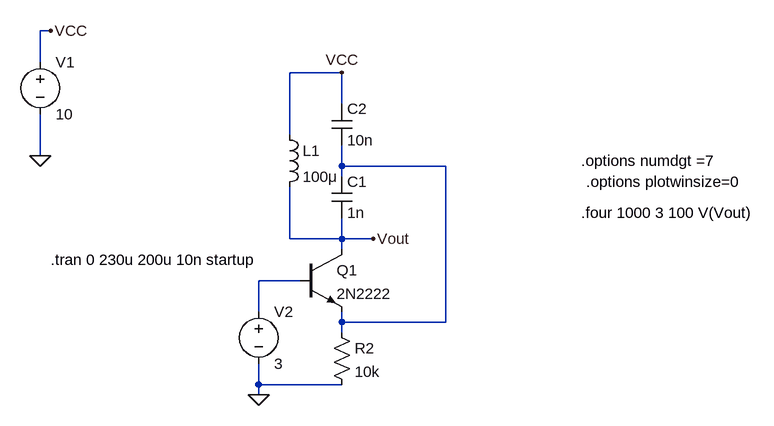
[diagram p0: schematic Ask2.asc]
Ask2.asc, the LTspice schematic file:
Version 4
SHEET 1 912 680
WIRE -224 -288 -240 -288
WIRE -240 -240 -240 -288
WIRE 224 -224 144 -224
WIRE 224 -176 224 -224
WIRE 144 -128 144 -224
WIRE -240 -96 -240 -160
WIRE 224 -80 224 -112
WIRE 384 -80 224 -80
WIRE 224 -64 224 -80
WIRE 144 32 144 -48
WIRE 224 32 224 0
WIRE 224 32 144 32
WIRE 272 32 224 32
WIRE 224 48 224 32
WIRE 160 96 96 96
WIRE 96 144 96 96
WIRE 224 160 224 144
WIRE 384 160 384 -80
WIRE 384 160 224 160
WIRE 224 176 224 160
WIRE 96 256 96 224
WIRE 224 256 96 256
WIRE 96 272 96 256
FLAG 96 272 0
FLAG 224 -224 VCC
FLAG -240 -96 0
FLAG -224 -288 VCC
FLAG 272 32 Vout
SYMBOL voltage 96 128 R0
SYMATTR InstName V2
SYMATTR Value 3
SYMBOL npn 160 48 R0
SYMATTR InstName Q1
SYMATTR Value 2N2222
SYMBOL res 208 160 R0
SYMATTR InstName R2
SYMATTR Value 10k
SYMBOL cap 208 -64 R0
SYMATTR InstName C1
SYMATTR Value 1n
SYMBOL cap 208 -176 R0
SYMATTR InstName C2
SYMATTR Value 10n
SYMBOL ind 128 -144 R0
SYMATTR InstName L1
SYMATTR Value 100μ
SYMBOL voltage -240 -256 R0
SYMATTR InstName V1
SYMATTR Value 10
TEXT -224 64 Left 2 !.tran 0 230u 200u 10n startup
TEXT 592 -88 Left 2 !.options numdgt =7
TEXT 600 -56 Left 2 !.options plotwinsize=0
TEXT 592 -8 Left 2 !.four 1000 3 100 V(Vout)

The netlist it stands for:
* Ask2.asc
V2 N002 0 3
Q1 Vout N002 N001 0 2N2222
R2 N001 0 10k
C1 N001 Vout 1n
C2 VCC N001 10n
L1 VCC Vout 100μ
V1 VCC 0 10
.model NPN NPN
.model PNP PNP
.lib standard.bjt
.tran 0 230u 200u 10n startup
.options numdgt =7
.options plotwinsize=0
.four 1000 3 100 V(Vout)
.backanno
.end